# Altium project resistor_board_tcc.PrjPcb
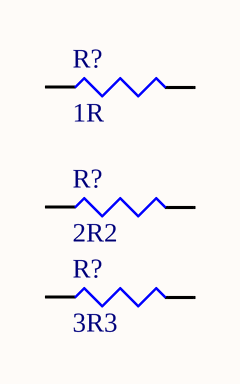
[diagram p0: Sheet1.SchDoc]
1 sheet, 3 parts. Net scope: global (net labels, ports and power ports of the same name join across sheets).
Board file: PCB1.PcbDoc

## Sheet Sheet1.SchDoc
size A4

### Parts
(Parts that share a designator on the sheet are numbered #1, #2 ... from top to bottom, then left to right.)
R?#1  1R  [R 10x35mm]
R?#2  2R2  [R 50x10mm]
R?#3  3R3  [R 50x10mm]

### Nets

Not connected (* = marked no-connect by the designer): R?#1 1 2; R?#2 1 2; R?#3 1 2

### Library data of the parts
R?#1 = SQP10AJB-1R: RES 1 OHM 10W 5% AXIAL; Manufacturer: Yageo; Supplier 1: Digi-Key; Supplier Part Number 1: 1.0W-10-ND; Manufacturer Part Number: SQP10AJB-1R; RoHS: Yes; Category: Through-Hole Resistors; Stock 1: 3556; Pricing 1: 1=0,81000, 10=0,70700, 25=0,62080, 50=0,56740, 100=0,49250, 250=0,42824, 500=0,35544, 1000=0,28906, 5000=0,27579 (USD); Case/Package: Axial; Min Operating Temperature: -55°C; Max Operating Temperature: 155°C; Composition: Wirewound; Number of Terminations: 2; Max Power Dissipation: 10W; Tolerance: 5%; Packaging: Bulk; Package Quantity: 500; Resistance: 1R; Features: Moisture Resistant; Length: 1.89inch; ComponentLink1URL: https://datasheet.ciiva.com/2715/yageolr-sqpnsp-2013-2715978.pdf?src-supplier=Digi-Key; ComponentLink1Description: https://datasheet.ciiva.com/2715/yageolr-sqpnsp-2013-2715978.pdf?src-supplier=Digi-Key
R?#2 = SQP10AJB-2R2: RES 2.2 OHM 10W 5% AXIAL; Manufacturer: Yageo; Voltage Rating (DC): 500V; Resistance: 2.2R; Supplier 1: Digi-Key; Supplier Part Number 1: 2.2W-10-ND; Manufacturer Part Number: SQP10AJB-2R2; RoHS: Yes; Category: Through-Hole Resistors; Stock 1: 2353; Pricing 1: 1=0,81000, 10=0,70700, 25=0,62080, 50=0,56740, 100=0,49250, 250=0,42824, 500=0,35544, 1000=0,28906, 5000=0,27579 (USD); Case/Package: Axial; Min Operating Temperature: -55°C; Max Operating Temperature: 155°C; Features: Moisture Resistant; Package Quantity: 500; Tolerance: 5%; Packaging: Bulk; Max Power Dissipation: 10W; Composition: Wirewound; Number of Terminations: 2; Length: 1.89inch; Lead Free: Lead Free; ComponentLink1URL: https://datasheet.ciiva.com/2715/yageolr-sqpnsp-2013-2715997.pdf?src-supplier=Digi-Key; ComponentLink1Description: https://datasheet.ciiva.com/2715/yageolr-sqpnsp-2013-2715997.pdf?src-supplier=Digi-Key
R?#3 = SQP10AJB-3R3: RES 3.3 OHM 10W 5% AXIAL; Manufacturer: Yageo; Resistance: 3.3R; Voltage Rating (DC): 500V; Supplier 1: Digi-Key; Supplier Part Number 1: 3.3W-10-ND; Manufacturer Part Number: SQP10AJB-3R3; RoHS: Yes; Category: Through-Hole Resistors; Stock 1: 3411; Pricing 1: 1=0,81000, 10=0,70700, 25=0,62080, 50=0,56740, 100=0,49250, 250=0,42824, 500=0,35544, 1000=0,28906, 5000=0,27579 (USD); Case/Package: Axial; Min Operating Temperature: -55°C; Max Operating Temperature: 155°C; Package Quantity: 500; Tolerance: 5%; Packaging: Bulk; Max Power Dissipation: 10W; Features: Moisture Resistant; Composition: Wirewound; Number of Terminations: 2; Length: 1.89inch; Lead Free: Lead Free; ComponentLink1URL: https://datasheet.ciiva.com/2723/yageolr-sqpnsp-2013-2723149.pdf?src-supplier=Digi-Key; ComponentLink1Description: https://datasheet.ciiva.com/2723/yageolr-sqpnsp-2013-2723149.pdf?src-supplier=Digi-Key